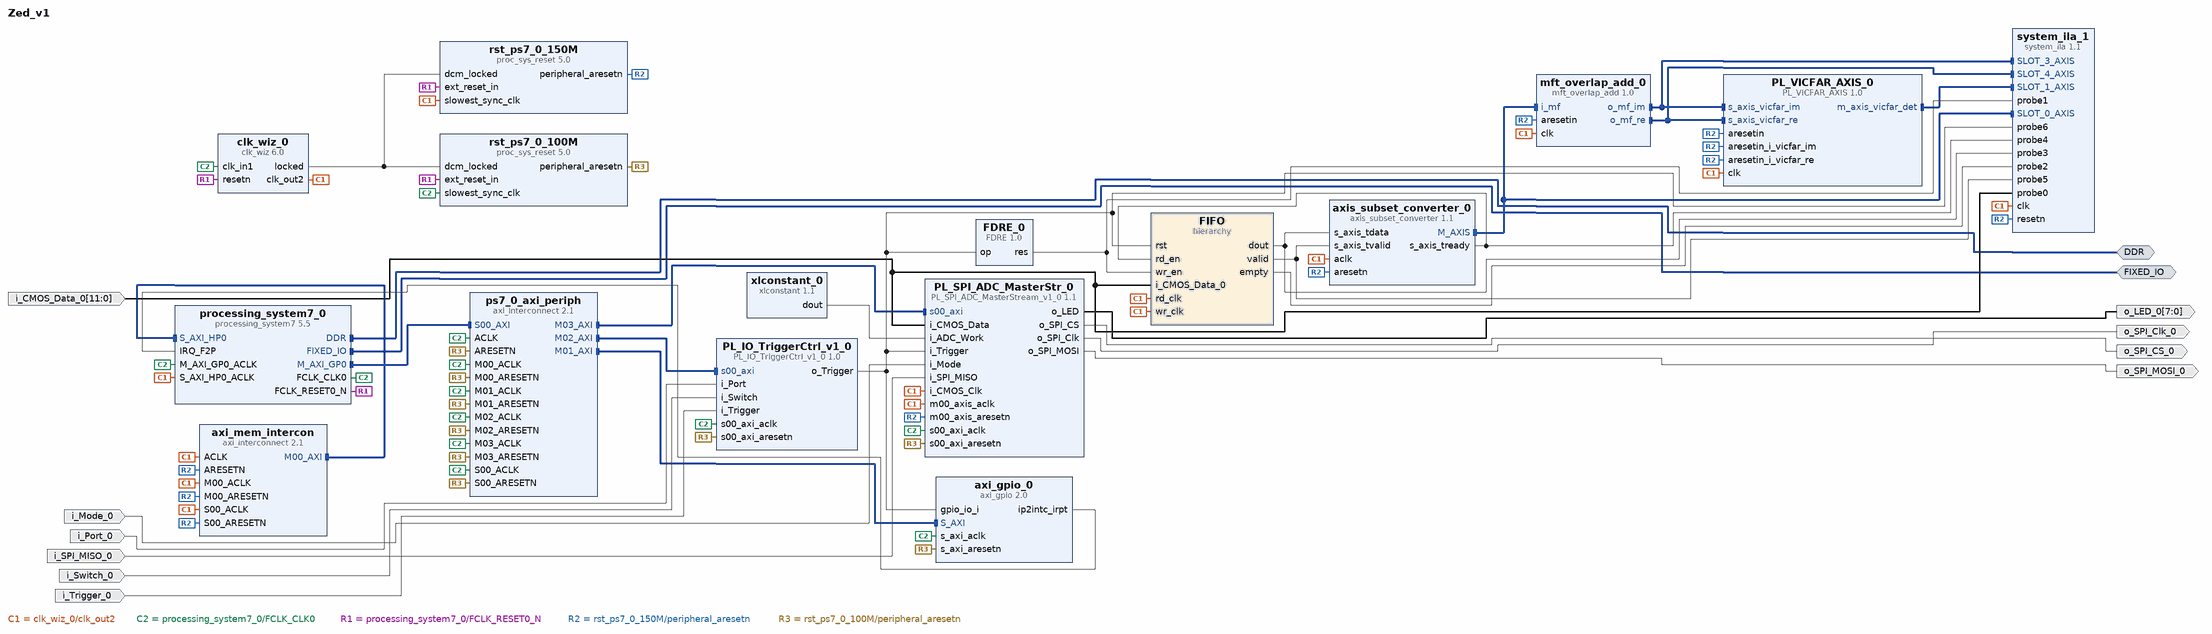
[diagram p0: block diagram of the top level]
# Vivado block design Zed_v1, xc7z020clg484-1, Vivado 2022.2
create_bd_design Zed_v1

create_bd_intf_port -mode Master -vlnv xilinx.com:interface:ddrx_rtl:1.0 DDR
create_bd_intf_port -mode Master -vlnv xilinx.com:display_processing_system7:fixedio_rtl:1.0 FIXED_IO
create_bd_port -dir O -type clk o_SPI_Clk_0
create_bd_port -dir O o_SPI_CS_0
create_bd_port -dir O -from 7 -to 0 o_LED_0
create_bd_port -dir I -from 11 -to 0 i_CMOS_Data_0
create_bd_port -dir I i_Mode_0
create_bd_port -dir I i_Trigger_0
create_bd_port -dir I i_Switch_0
create_bd_port -dir I i_Port_0
create_bd_port -dir O o_SPI_MOSI_0
create_bd_port -dir I i_SPI_MISO_0

create_bd_cell -type ip -vlnv xilinx.com:ip:axi_interconnect:2.1 ps7_0_axi_periph
set_property -dict {CONFIG.NUM_MI 4} [get_bd_cells ps7_0_axi_periph]
create_bd_cell -type ip -vlnv xilinx.com:ip:axi_interconnect:2.1 axi_mem_intercon
set_property -dict {CONFIG.NUM_MI 1 CONFIG.S00_HAS_DATA_FIFO 1 CONFIG.S00_HAS_REGSLICE 4} [get_bd_cells axi_mem_intercon]
create_bd_cell -type ip -vlnv user.org:user:PL_IO_TriggerCtrl_v1_0:1.0 PL_IO_TriggerCtrl_v1_0
create_bd_cell -type ip -vlnv xilinx.com:ip:xlconstant:1.1 xlconstant_0
create_bd_cell -type ip -vlnv user.org:user:PL_SPI_ADC_MasterStream_v1_0:1.1 PL_SPI_ADC_MasterStr_0
set_property -dict {CONFIG.C_M00_AXIS_START_COUNT 2} [get_bd_cells PL_SPI_ADC_MasterStr_0]
create_bd_cell -type ip -vlnv xilinx.com:ip:axi_gpio:2.0 axi_gpio_0
set_property -dict [list \
  CONFIG.C_ALL_INPUTS 1 \
  CONFIG.C_GPIO_WIDTH 1 \
  CONFIG.C_INTERRUPT_PRESENT 1 \
  CONFIG.GPIO_BOARD_INTERFACE Custom \
] [get_bd_cells axi_gpio_0]
create_bd_cell -type ip -vlnv xilinx.com:ip:clk_wiz:6.0 clk_wiz_0
set_property -dict [list \
  CONFIG.CLKIN1_JITTER_PS 600.0 \
  CONFIG.CLKIN1_UI_JITTER 0.060 \
  CONFIG.CLKOUT1_JITTER 126.133 \
  CONFIG.CLKOUT1_PHASE_ERROR 94.994 \
  CONFIG.CLKOUT2_JITTER 116.798 \
  CONFIG.CLKOUT2_PHASE_ERROR 94.994 \
  CONFIG.CLKOUT2_REQUESTED_OUT_FREQ 150 \
  CONFIG.CLKOUT2_USED true \
  CONFIG.MMCM_CLKFBOUT_MULT_F 10.500 \
  CONFIG.MMCM_CLKOUT0_DIVIDE_F 10.500 \
  CONFIG.MMCM_CLKOUT1_DIVIDE 7 \
  CONFIG.MMCM_REF_JITTER1 0.060 \
  CONFIG.NUM_OUT_CLKS 2 \
  CONFIG.RESET_PORT resetn \
  CONFIG.RESET_TYPE ACTIVE_LOW \
  CONFIG.USE_LOCKED true \
  CONFIG.USE_RESET true \
] [get_bd_cells clk_wiz_0]
create_bd_cell -type ip -vlnv xilinx.com:ip:processing_system7:5.5 processing_system7_0
set_property -dict [list \
  CONFIG.PCW_APU_PERIPHERAL_FREQMHZ 666.666667 \
  CONFIG.PCW_ENET0_ENET0_IO {MIO 16 .. 27} \
  CONFIG.PCW_ENET0_GRP_MDIO_ENABLE 1 \
  CONFIG.PCW_ENET0_GRP_MDIO_IO {MIO 52 .. 53} \
  CONFIG.PCW_ENET0_PERIPHERAL_ENABLE 1 \
  CONFIG.PCW_ENET0_RESET_ENABLE 0 \
  CONFIG.PCW_ENET_RESET_ENABLE 1 \
  CONFIG.PCW_ENET_RESET_SELECT {Share reset pin} \
  CONFIG.PCW_FPGA0_PERIPHERAL_FREQMHZ 100.000000 \
  CONFIG.PCW_FPGA1_PERIPHERAL_FREQMHZ 150.000000 \
  CONFIG.PCW_GPIO_MIO_GPIO_ENABLE 1 \
  CONFIG.PCW_GPIO_MIO_GPIO_IO MIO \
  CONFIG.PCW_I2C_RESET_ENABLE 1 \
  CONFIG.PCW_IRQ_F2P_INTR 1 \
  CONFIG.PCW_PERIPHERAL_BOARD_PRESET part0 \
  CONFIG.PCW_PRESET_BANK1_VOLTAGE {LVCMOS 1.8V} \
  CONFIG.PCW_QSPI_GRP_SINGLE_SS_ENABLE 1 \
  CONFIG.PCW_QSPI_GRP_SINGLE_SS_IO {MIO 1 .. 6} \
  CONFIG.PCW_QSPI_PERIPHERAL_ENABLE 1 \
  CONFIG.PCW_QSPI_QSPI_IO {MIO 1 .. 6} \
  CONFIG.PCW_SD0_GRP_CD_ENABLE 1 \
  CONFIG.PCW_SD0_GRP_CD_IO {MIO 47} \
  CONFIG.PCW_SD0_GRP_WP_ENABLE 1 \
  CONFIG.PCW_SD0_GRP_WP_IO {MIO 46} \
  CONFIG.PCW_SD0_PERIPHERAL_ENABLE 1 \
  CONFIG.PCW_SD0_SD0_IO {MIO 40 .. 45} \
  CONFIG.PCW_SDIO_PERIPHERAL_FREQMHZ 50 \
  CONFIG.PCW_SINGLE_QSPI_DATA_MODE x4 \
  CONFIG.PCW_UART1_PERIPHERAL_ENABLE 1 \
  CONFIG.PCW_UART1_UART1_IO {MIO 48 .. 49} \
  CONFIG.PCW_UART_PERIPHERAL_FREQMHZ 50 \
  CONFIG.PCW_UIPARAM_DDR_FREQ_MHZ 533.333313 \
  CONFIG.PCW_UIPARAM_DDR_PARTNO {MT41J128M16 HA-15E} \
  CONFIG.PCW_USB0_PERIPHERAL_ENABLE 1 \
  CONFIG.PCW_USB0_RESET_ENABLE 0 \
  CONFIG.PCW_USB0_USB0_IO {MIO 28 .. 39} \
  CONFIG.PCW_USB_RESET_ENABLE 1 \
  CONFIG.PCW_USB_RESET_SELECT {Share reset pin} \
  CONFIG.PCW_USE_FABRIC_INTERRUPT 1 \
  CONFIG.PCW_USE_S_AXI_HP0 1 \
  CONFIG.preset ZedBoard \
] [get_bd_cells processing_system7_0]
# 511 more settings of processing_system7_0 are not shown: defaults, MIO pin electricals, DDR timing, and values the tool derives
create_bd_cell -type ip -vlnv xilinx.com:ip:proc_sys_reset:5.0 rst_ps7_0_100M
create_bd_cell -type ip -vlnv xilinx.com:ip:proc_sys_reset:5.0 rst_ps7_0_150M
create_bd_cell -type ip -vlnv user.org:user:FDRE:1.0 FDRE_0
create_bd_cell -type ip -vlnv xilinx.com:ip:system_ila:1.1 system_ila_1
set_property -dict [list \
  CONFIG.C_DATA_DEPTH 4096 \
  CONFIG.C_MON_TYPE MIX \
  CONFIG.C_NUM_MONITOR_SLOTS 5 \
  CONFIG.C_NUM_OF_PROBES 7 \
  CONFIG.C_SLOT 2 \
  CONFIG.C_SLOT_0_INTF_TYPE xilinx.com:interface:axis_rtl:1.0 \
  CONFIG.C_SLOT_1_INTF_TYPE xilinx.com:interface:axis_rtl:1.0 \
  CONFIG.C_SLOT_2_INTF_TYPE xilinx.com:interface:axis_rtl:1.0 \
  CONFIG.C_SLOT_3_INTF_TYPE xilinx.com:interface:axis_rtl:1.0 \
  CONFIG.C_SLOT_4_INTF_TYPE xilinx.com:interface:axis_rtl:1.0 \
] [get_bd_cells system_ila_1]
create_bd_cell -type hier FIFO
create_bd_cell -type ip -vlnv xilinx.com:ip:axis_subset_converter:1.1 axis_subset_converter_0
set_property -dict {CONFIG.M_TDATA_NUM_BYTES 4 CONFIG.S_TDATA_NUM_BYTES 2} [get_bd_cells axis_subset_converter_0]
create_bd_cell -type ip -vlnv User_Company:SysGen:PL_VICFAR_AXIS:1.0 PL_VICFAR_AXIS_0
create_bd_cell -type ip -vlnv User_Company:SysGen:mft_overlap_add:1.0 mft_overlap_add_0

# ---- hierarchy /FIFO ----
current_bd_instance /FIFO
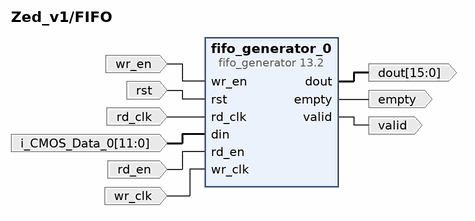
[diagram p1: block diagram inside /FIFO]
create_bd_pin -dir I rst
create_bd_pin -dir I -type clk rd_clk
create_bd_pin -dir I -from 11 -to 0 i_CMOS_Data_0
create_bd_pin -dir I wr_en
create_bd_pin -dir I rd_en
create_bd_pin -dir O -from 15 -to 0 dout
create_bd_pin -dir O empty
create_bd_pin -dir O valid
create_bd_pin -dir I -type clk wr_clk

create_bd_cell -type ip -vlnv xilinx.com:ip:fifo_generator:13.2 fifo_generator_0
set_property -dict [list \
  CONFIG.Almost_Empty_Flag false \
  CONFIG.Almost_Full_Flag false \
  CONFIG.Clock_Type_AXI Independent_Clock \
  CONFIG.Enable_ECC false \
  CONFIG.Fifo_Implementation Independent_Clocks_Block_RAM \
  CONFIG.INTERFACE_TYPE Native \
  CONFIG.Input_Data_Width 16 \
  CONFIG.Performance_Options First_Word_Fall_Through \
  CONFIG.Programmable_Empty_Type No_Programmable_Empty_Threshold \
  CONFIG.Programmable_Full_Type No_Programmable_Full_Threshold \
  CONFIG.Reset_Pin true \
  CONFIG.Use_Embedded_Registers false \
  CONFIG.Valid_Flag true \
  CONFIG.Write_Acknowledge_Flag true \
  CONFIG.Write_Data_Count false \
  CONFIG.synchronization_stages 3 \
] [get_bd_cells fifo_generator_0]

# ---- connections ----

current_bd_instance /FIFO
connect_bd_net -net FDRE_0_res [get_bd_pins wr_en] [get_bd_pins fifo_generator_0/wr_en]
connect_bd_net -net PL_IO_TriggerCtrl_v1_0_o_Trigger [get_bd_pins rst] [get_bd_pins fifo_generator_0/rst]
connect_bd_net -net clk_wiz_0_clk_out2 [get_bd_pins rd_clk] [get_bd_pins fifo_generator_0/rd_clk]
connect_bd_net -net fifo_generator_0_dout [get_bd_pins fifo_generator_0/dout] [get_bd_pins dout]
connect_bd_net -net fifo_generator_0_empty [get_bd_pins fifo_generator_0/empty] [get_bd_pins empty]
connect_bd_net -net fifo_generator_0_valid [get_bd_pins fifo_generator_0/valid] [get_bd_pins valid]
connect_bd_net -net i_CMOS_Data_0_1 [get_bd_pins i_CMOS_Data_0] [get_bd_pins fifo_generator_0/din]
connect_bd_net -net rd_en_1 [get_bd_pins rd_en] [get_bd_pins fifo_generator_0/rd_en]
connect_bd_net -net wr_clk_1 [get_bd_pins wr_clk] [get_bd_pins fifo_generator_0/wr_clk]
set_property HDL_ATTRIBUTE.DEBUG true [get_bd_nets FDRE_0_res]
set_property HDL_ATTRIBUTE.DEBUG true [get_bd_nets PL_IO_TriggerCtrl_v1_0_o_Trigger]
set_property HDL_ATTRIBUTE.DEBUG true [get_bd_nets clk_wiz_0_clk_out2]
set_property HDL_ATTRIBUTE.DEBUG true [get_bd_nets fifo_generator_0_dout]
set_property HDL_ATTRIBUTE.DEBUG true [get_bd_nets fifo_generator_0_empty]
set_property HDL_ATTRIBUTE.DEBUG true [get_bd_nets fifo_generator_0_valid]
set_property HDL_ATTRIBUTE.DEBUG true [get_bd_nets i_CMOS_Data_0_1]
set_property HDL_ATTRIBUTE.DEBUG true [get_bd_nets rd_en_1]
set_property HDL_ATTRIBUTE.DEBUG true [get_bd_nets wr_clk_1]

current_bd_instance /
connect_bd_intf_net [get_bd_intf_pins PL_VICFAR_AXIS_0/m_axis_vicfar_det] [get_bd_intf_pins system_ila_1/SLOT_1_AXIS]
connect_bd_intf_net [get_bd_intf_pins axi_mem_intercon/M00_AXI] [get_bd_intf_pins processing_system7_0/S_AXI_HP0]
connect_bd_intf_net [get_bd_intf_pins axis_subset_converter_0/M_AXIS] [get_bd_intf_pins mft_overlap_add_0/i_mf]
connect_bd_intf_net [get_bd_intf_pins axis_subset_converter_0/M_AXIS] [get_bd_intf_pins system_ila_1/SLOT_0_AXIS]
connect_bd_intf_net [get_bd_intf_pins PL_VICFAR_AXIS_0/s_axis_vicfar_im] [get_bd_intf_pins mft_overlap_add_0/o_mf_im]
connect_bd_intf_net [get_bd_intf_pins PL_VICFAR_AXIS_0/s_axis_vicfar_im] [get_bd_intf_pins system_ila_1/SLOT_3_AXIS]
connect_bd_intf_net [get_bd_intf_pins mft_overlap_add_0/o_mf_re] [get_bd_intf_pins PL_VICFAR_AXIS_0/s_axis_vicfar_re]
connect_bd_intf_net [get_bd_intf_pins mft_overlap_add_0/o_mf_re] [get_bd_intf_pins system_ila_1/SLOT_4_AXIS]
connect_bd_intf_net [get_bd_intf_ports DDR] [get_bd_intf_pins processing_system7_0/DDR]
connect_bd_intf_net [get_bd_intf_ports FIXED_IO] [get_bd_intf_pins processing_system7_0/FIXED_IO]
connect_bd_intf_net [get_bd_intf_pins processing_system7_0/M_AXI_GP0] [get_bd_intf_pins ps7_0_axi_periph/S00_AXI]
connect_bd_intf_net [get_bd_intf_pins ps7_0_axi_periph/M01_AXI] [get_bd_intf_pins axi_gpio_0/S_AXI]
connect_bd_intf_net [get_bd_intf_pins ps7_0_axi_periph/M02_AXI] [get_bd_intf_pins PL_IO_TriggerCtrl_v1_0/s00_axi]
connect_bd_intf_net [get_bd_intf_pins ps7_0_axi_periph/M03_AXI] [get_bd_intf_pins PL_SPI_ADC_MasterStr_0/s00_axi]
connect_bd_net -net FDRE_0_res [get_bd_pins FDRE_0/res] [get_bd_pins system_ila_1/probe1] [get_bd_pins FIFO/wr_en]
connect_bd_net -net PL_IO_TriggerCtrl_v1_0_o_Trigger [get_bd_pins PL_IO_TriggerCtrl_v1_0/o_Trigger] \
  [get_bd_pins PL_SPI_ADC_MasterStr_0/i_Trigger] [get_bd_pins axi_gpio_0/gpio_io_i] [get_bd_pins FDRE_0/op] \
  [get_bd_pins system_ila_1/probe6] [get_bd_pins FIFO/rst]
connect_bd_net [get_bd_pins PL_SPI_ADC_MasterStr_0/o_LED] [get_bd_ports o_LED_0]
connect_bd_net [get_bd_pins PL_SPI_ADC_MasterStr_0/o_SPI_CS] [get_bd_ports o_SPI_CS_0]
connect_bd_net [get_bd_pins PL_SPI_ADC_MasterStr_0/o_SPI_Clk] [get_bd_ports o_SPI_Clk_0]
connect_bd_net [get_bd_pins PL_SPI_ADC_MasterStr_0/o_SPI_MOSI] [get_bd_ports o_SPI_MOSI_0]
connect_bd_net -net axi_dma_0_s_axis_s2mm_tready [get_bd_pins axis_subset_converter_0/s_axis_tready] \
  [get_bd_pins system_ila_1/probe4] [get_bd_pins FIFO/rd_en]
connect_bd_net [get_bd_pins axi_gpio_0/ip2intc_irpt] [get_bd_pins processing_system7_0/IRQ_F2P]
connect_bd_net -net clk_wiz_0_clk_out2 [get_bd_pins clk_wiz_0/clk_out2] \
  [get_bd_pins axi_mem_intercon/ACLK] [get_bd_pins axi_mem_intercon/M00_ACLK] [get_bd_pins axi_mem_intercon/S00_ACLK] \
  [get_bd_pins PL_SPI_ADC_MasterStr_0/i_CMOS_Clk] [get_bd_pins PL_SPI_ADC_MasterStr_0/m00_axis_aclk] \
  [get_bd_pins processing_system7_0/S_AXI_HP0_ACLK] [get_bd_pins rst_ps7_0_150M/slowest_sync_clk] \
  [get_bd_pins system_ila_1/clk] [get_bd_pins FIFO/rd_clk] [get_bd_pins axis_subset_converter_0/aclk] \
  [get_bd_pins FIFO/wr_clk] [get_bd_pins PL_VICFAR_AXIS_0/clk] [get_bd_pins mft_overlap_add_0/clk]
connect_bd_net [get_bd_pins clk_wiz_0/locked] [get_bd_pins rst_ps7_0_100M/dcm_locked] [get_bd_pins rst_ps7_0_150M/dcm_locked]
connect_bd_net -net fifo_generator_0_dout [get_bd_pins FIFO/dout] [get_bd_pins system_ila_1/probe3] [get_bd_pins axis_subset_converter_0/s_axis_tdata]
connect_bd_net -net fifo_generator_0_empty [get_bd_pins FIFO/empty] [get_bd_pins system_ila_1/probe2]
connect_bd_net -net fifo_generator_0_valid [get_bd_pins FIFO/valid] \
  [get_bd_pins system_ila_1/probe5] [get_bd_pins axis_subset_converter_0/s_axis_tvalid]
connect_bd_net -net i_CMOS_Data_0_1 [get_bd_ports i_CMOS_Data_0] \
  [get_bd_pins PL_SPI_ADC_MasterStr_0/i_CMOS_Data] [get_bd_pins system_ila_1/probe0] [get_bd_pins FIFO/i_CMOS_Data_0]
connect_bd_net -net i_Mode_0_1 [get_bd_ports i_Mode_0] [get_bd_pins PL_SPI_ADC_MasterStr_0/i_Mode]
connect_bd_net -net i_Port_0_1 [get_bd_ports i_Port_0] [get_bd_pins PL_IO_TriggerCtrl_v1_0/i_Port]
connect_bd_net -net i_SPI_MISO_0_1 [get_bd_ports i_SPI_MISO_0] [get_bd_pins PL_SPI_ADC_MasterStr_0/i_SPI_MISO]
connect_bd_net -net i_Switch_0_1 [get_bd_ports i_Switch_0] [get_bd_pins PL_IO_TriggerCtrl_v1_0/i_Switch]
connect_bd_net -net i_Trigger_0_1 [get_bd_ports i_Trigger_0] [get_bd_pins PL_IO_TriggerCtrl_v1_0/i_Trigger]
connect_bd_net [get_bd_pins processing_system7_0/FCLK_CLK0] \
  [get_bd_pins clk_wiz_0/clk_in1] [get_bd_pins axi_gpio_0/s_axi_aclk] [get_bd_pins ps7_0_axi_periph/M01_ACLK] \
  [get_bd_pins PL_IO_TriggerCtrl_v1_0/s00_axi_aclk] [get_bd_pins ps7_0_axi_periph/M02_ACLK] \
  [get_bd_pins PL_SPI_ADC_MasterStr_0/s00_axi_aclk] [get_bd_pins ps7_0_axi_periph/M03_ACLK] \
  [get_bd_pins processing_system7_0/M_AXI_GP0_ACLK] [get_bd_pins ps7_0_axi_periph/S00_ACLK] \
  [get_bd_pins ps7_0_axi_periph/ACLK] [get_bd_pins rst_ps7_0_100M/slowest_sync_clk] [get_bd_pins ps7_0_axi_periph/M00_ACLK]
connect_bd_net [get_bd_pins processing_system7_0/FCLK_RESET0_N] \
  [get_bd_pins clk_wiz_0/resetn] [get_bd_pins rst_ps7_0_100M/ext_reset_in] [get_bd_pins rst_ps7_0_150M/ext_reset_in]
connect_bd_net -net rst_ps7_0_100M1_peripheral_aresetn [get_bd_pins rst_ps7_0_150M/peripheral_aresetn] \
  [get_bd_pins axi_mem_intercon/ARESETN] [get_bd_pins axi_mem_intercon/M00_ARESETN] \
  [get_bd_pins axi_mem_intercon/S00_ARESETN] [get_bd_pins PL_SPI_ADC_MasterStr_0/m00_axis_aresetn] \
  [get_bd_pins axis_subset_converter_0/aresetn] [get_bd_pins system_ila_1/resetn] [get_bd_pins PL_VICFAR_AXIS_0/aresetin] \
  [get_bd_pins PL_VICFAR_AXIS_0/aresetin_i_vicfar_im] [get_bd_pins PL_VICFAR_AXIS_0/aresetin_i_vicfar_re] \
  [get_bd_pins mft_overlap_add_0/aresetin]
connect_bd_net [get_bd_pins rst_ps7_0_100M/peripheral_aresetn] \
  [get_bd_pins ps7_0_axi_periph/ARESETN] [get_bd_pins ps7_0_axi_periph/M00_ARESETN] \
  [get_bd_pins ps7_0_axi_periph/M01_ARESETN] [get_bd_pins ps7_0_axi_periph/M02_ARESETN] \
  [get_bd_pins ps7_0_axi_periph/M03_ARESETN] [get_bd_pins ps7_0_axi_periph/S00_ARESETN] \
  [get_bd_pins PL_IO_TriggerCtrl_v1_0/s00_axi_aresetn] [get_bd_pins PL_SPI_ADC_MasterStr_0/s00_axi_aresetn] \
  [get_bd_pins axi_gpio_0/s_axi_aresetn]
connect_bd_net [get_bd_pins xlconstant_0/dout] [get_bd_pins PL_SPI_ADC_MasterStr_0/i_ADC_Work]
set_property HDL_ATTRIBUTE.DEBUG true [get_bd_nets FDRE_0_res]
set_property HDL_ATTRIBUTE.MARK_DEBUG true [get_bd_nets FDRE_0_res]
set_property HDL_ATTRIBUTE.DEBUG true [get_bd_nets PL_IO_TriggerCtrl_v1_0_o_Trigger]
set_property HDL_ATTRIBUTE.MARK_DEBUG true [get_bd_nets PL_IO_TriggerCtrl_v1_0_o_Trigger]
set_property HDL_ATTRIBUTE.DEBUG true [get_bd_nets axi_dma_0_s_axis_s2mm_tready]
set_property HDL_ATTRIBUTE.MARK_DEBUG true [get_bd_nets axi_dma_0_s_axis_s2mm_tready]
set_property HDL_ATTRIBUTE.DEBUG true [get_bd_nets clk_wiz_0_clk_out2]
set_property HDL_ATTRIBUTE.DEBUG true [get_bd_nets fifo_generator_0_dout]
set_property HDL_ATTRIBUTE.MARK_DEBUG true [get_bd_nets fifo_generator_0_dout]
set_property HDL_ATTRIBUTE.DEBUG true [get_bd_nets fifo_generator_0_empty]
set_property HDL_ATTRIBUTE.MARK_DEBUG true [get_bd_nets fifo_generator_0_empty]
set_property HDL_ATTRIBUTE.DEBUG true [get_bd_nets fifo_generator_0_valid]
set_property HDL_ATTRIBUTE.MARK_DEBUG true [get_bd_nets fifo_generator_0_valid]
set_property HDL_ATTRIBUTE.DEBUG true [get_bd_nets i_CMOS_Data_0_1]
set_property HDL_ATTRIBUTE.MARK_DEBUG true [get_bd_nets i_CMOS_Data_0_1]

# ---- address map ----
assign_bd_address -offset 0x41200000 -range 64K -target_address_space [get_bd_addr_spaces processing_system7_0/Data] [get_bd_addr_segs axi_gpio_0/S_AXI/Reg]
assign_bd_address -offset 0x43C00000 -range 64K -target_address_space [get_bd_addr_spaces processing_system7_0/Data] [get_bd_addr_segs PL_IO_TriggerCtrl_v1_0/s00_axi/reg0]
assign_bd_address -offset 0x43C20000 -range 64K -target_address_space [get_bd_addr_spaces processing_system7_0/Data] [get_bd_addr_segs PL_SPI_ADC_MasterStr_0/s00_axi/reg0]

validate_bd_design
save_bd_design
